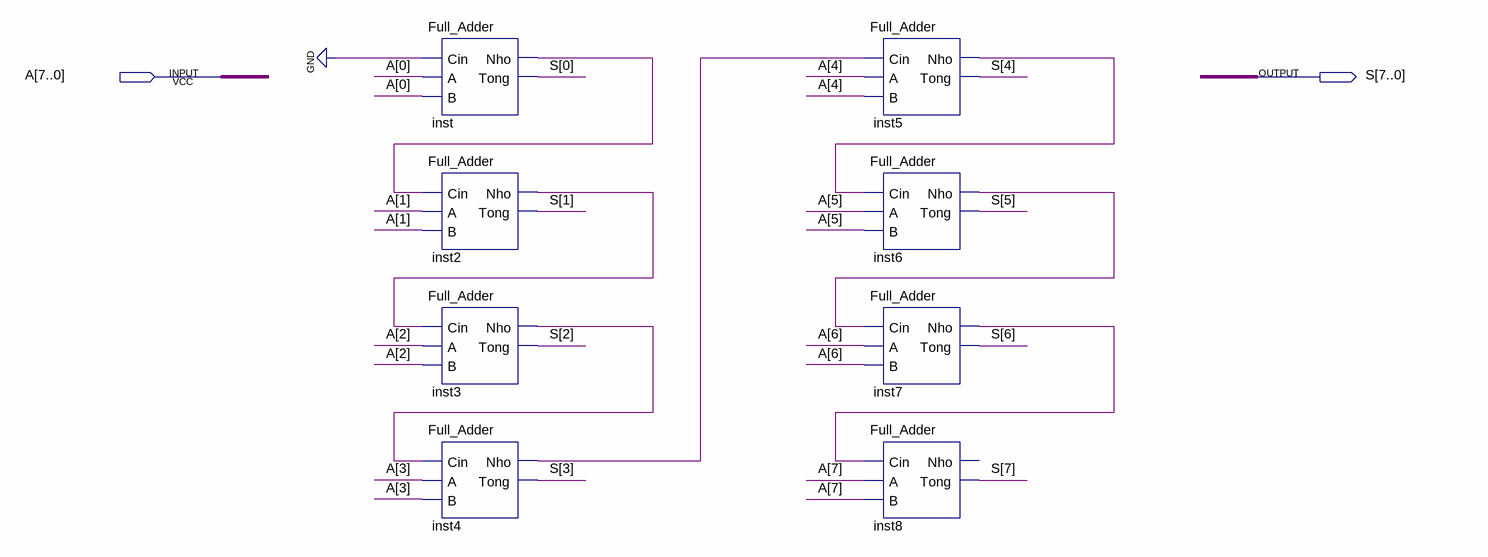
[diagram p0: schematic sheet]
// Quartus schematic Full_Adder_8bit.bdf as structural Verilog: 8 symbols, 2 pins
module Full_Adder_8bit (
  input  [7:0] A,
  output [7:0] S
);

  wire inst2_nho, inst3_nho, inst4_nho, inst5_nho, inst6_nho, inst7_nho, inst_nho;

  Full_Adder inst (.Cin(1'b0), .A(A[0]), .B(A[0]), .Nho(inst_nho), .Tong(S[0]));
  Full_Adder inst2 (.Cin(inst_nho), .A(A[1]), .B(A[1]), .Nho(inst2_nho), .Tong(S[1]));
  Full_Adder inst3 (.Cin(inst2_nho), .A(A[2]), .B(A[2]), .Nho(inst3_nho), .Tong(S[2]));
  Full_Adder inst4 (.Cin(inst3_nho), .A(A[3]), .B(A[3]), .Nho(inst4_nho), .Tong(S[3]));
  Full_Adder inst5 (.Cin(inst4_nho), .A(A[4]), .B(A[4]), .Nho(inst5_nho), .Tong(S[4]));
  Full_Adder inst6 (.Cin(inst5_nho), .A(A[5]), .B(A[5]), .Nho(inst6_nho), .Tong(S[5]));
  Full_Adder inst7 (.Cin(inst6_nho), .A(A[6]), .B(A[6]), .Nho(inst7_nho), .Tong(S[6]));
  Full_Adder inst8 (.Cin(inst7_nho), .A(A[7]), .B(A[7]), .Tong(S[7]));  // open: Nho
endmodule
